# Altium schematic sheet ind_8700.SchDoc
size A4
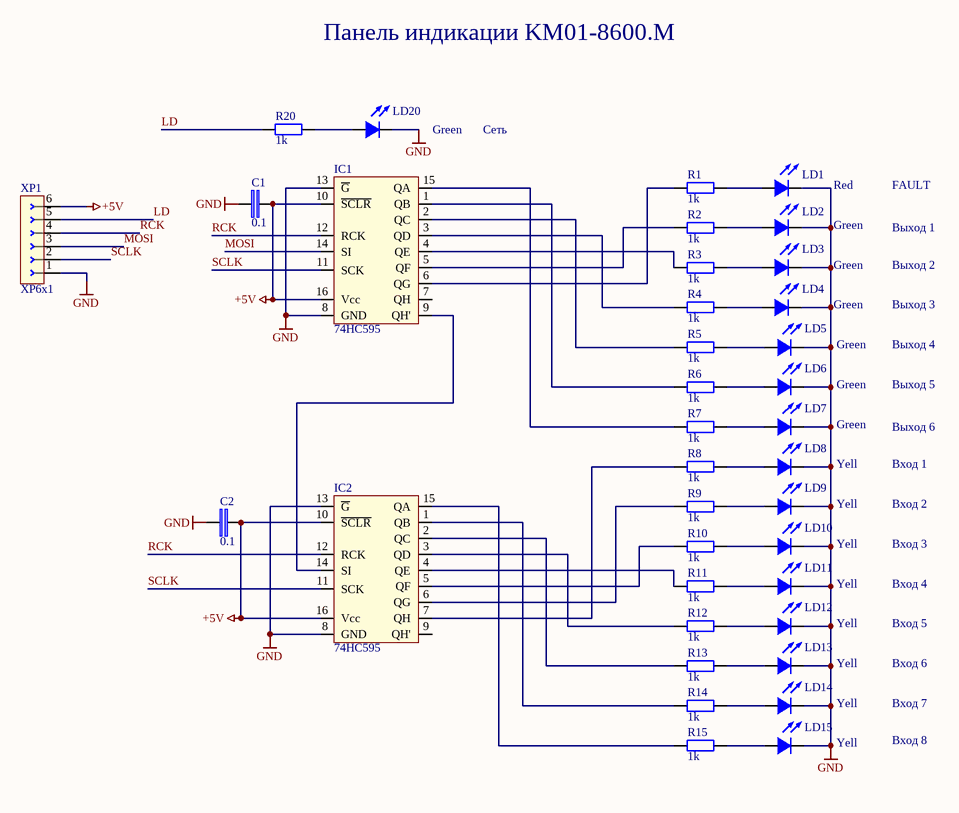
[diagram p0: ind_8700.SchDoc]

## Parts
C1  0.1  [CAPC2113X13N_0805]
C2  0.1  [CAPC2113X13N_0805]
IC1  74HC595  [SOIC_16_74hc]
IC2  74HC595  [SOIC_16_74hc]
LD1  Red  [LED_3]
LD2  Green  [LED_3]
LD3  Green  [LED_3]
LD4  Green  [LED_3]
LD5  Green  [LED_3]
LD6  Green  [LED_3]
LD7  Green  [LED_3]
LD8  Yell  [LED_3]
LD9  Yell  [LED_3]
LD10  Yell  [LED_3]
LD11  Yell  [LED_3]
LD12  Yell  [LED_3]
LD13  Yell  [LED_3]
LD14  Yell  [LED_3]
LD15  Yell  [LED_3]
LD20  Green  [LED_3]
R1  1k  [RESC2113X0805N]
R2  1k  [RESC2113X0805N]
R3  1k  [RESC2113X0805N]
R4  1k  [RESC2113X0805N]
R5  1k  [RESC2113X0805N]
R6  1k  [RESC2113X0805N]
R7  1k  [RESC2113X0805N]
R8  1k  [RESC2113X0805N]
R9  1k  [RESC2113X0805N]
R10  1k  [RESC2113X0805N]
R11  1k  [RESC2113X0805N]
R12  1k  [RESC2113X0805N]
R13  1k  [RESC2113X0805N]
R14  1k  [RESC2113X0805N]
R15  1k  [RESC2113X0805N]
R20  1k  [RESC2113X0805N]
XP1  XP6x1  [Connect6_1]

## Nets
+5V: C1.2 C2.2 IC1.10(~{SCLR}) IC1.16(Vcc) IC2.10(~{SCLR}) IC2.16(Vcc) XP1.6
GND: C1.1 C2.1 IC1.8(GND) IC1.13(~{G}) IC2.8(GND) IC2.13(~{G}) LD1.2 LD2.2 LD3.2 LD4.2 LD5.2 LD6.2 LD7.2 LD8.2 LD9.2 LD10.2 LD11.2 LD12.2 LD13.2 LD14.2 LD15.2 LD20.2 XP1.1
LD: R20.2 XP1.5
MOSI: IC1.14(SI) XP1.3
RCK: IC1.12(RCK) IC2.12(RCK) XP1.4
SCLK: IC1.11(SCK) IC2.11(SCK) XP1.2
NetIC1_1: IC1.1(QB) R6.2
NetIC1_2: IC1.2(QC) R5.2
NetIC1_3: IC1.3(QD) R4.2
NetIC1_4: IC1.4(QE) R3.2
NetIC1_5: IC1.5(QF) R2.2
NetIC1_6: IC1.6(QG) R1.2
NetIC1_9: IC1.9(QH') IC2.14(SI)
NetIC1_15: IC1.15(QA) R7.2
NetIC2_1: IC2.1(QB) R14.2
NetIC2_2: IC2.2(QC) R13.2
NetIC2_3: IC2.3(QD) R12.2
NetIC2_4: IC2.4(QE) R11.2
NetIC2_5: IC2.5(QF) R10.2
NetIC2_6: IC2.6(QG) R9.2
NetIC2_7: IC2.7(QH) R8.2
NetIC2_15: IC2.15(QA) R15.2
NetLD1_1: LD1.1 R1.1
NetLD2_1: LD2.1 R2.1
NetLD3_1: LD3.1 R3.1
NetLD4_1: LD4.1 R4.1
NetLD5_1: LD5.1 R5.1
NetLD6_1: LD6.1 R6.1
NetLD7_1: LD7.1 R7.1
NetLD8_1: LD8.1 R8.1
NetLD9_1: LD9.1 R9.1
NetLD10_1: LD10.1 R10.1
NetLD11_1: LD11.1 R11.1
NetLD12_1: LD12.1 R12.1
NetLD13_1: LD13.1 R13.1
NetLD14_1: LD14.1 R14.1
NetLD15_1: LD15.1 R15.1
NetLD20_1: LD20.1 R20.1

Not connected (* = marked no-connect by the designer): IC1 7(QH); IC2 9(QH')

## Notes on the sheet
- Панель индикации KM01-8600.M
- Сеть
- Выход 1
- FAULT
- Выход 2
- Выход 3
- Выход 4
- Выход 5
- Выход 6
- Вход 1
- Вход 2
- Вход 3
- Вход 4
- Вход 5
- Вход 6
- Вход 7
- Вход 8

## Library data of the parts
C1 C2 = cap_1
IC1 IC2 = 74hc595_1
LD1-LD15 LD20 = LED_1
R1-R15 R20 = rez_1
XP1 = Connect6_1